# Altium schematic sheet MotorTreiber-µC.SchDoc
size A4
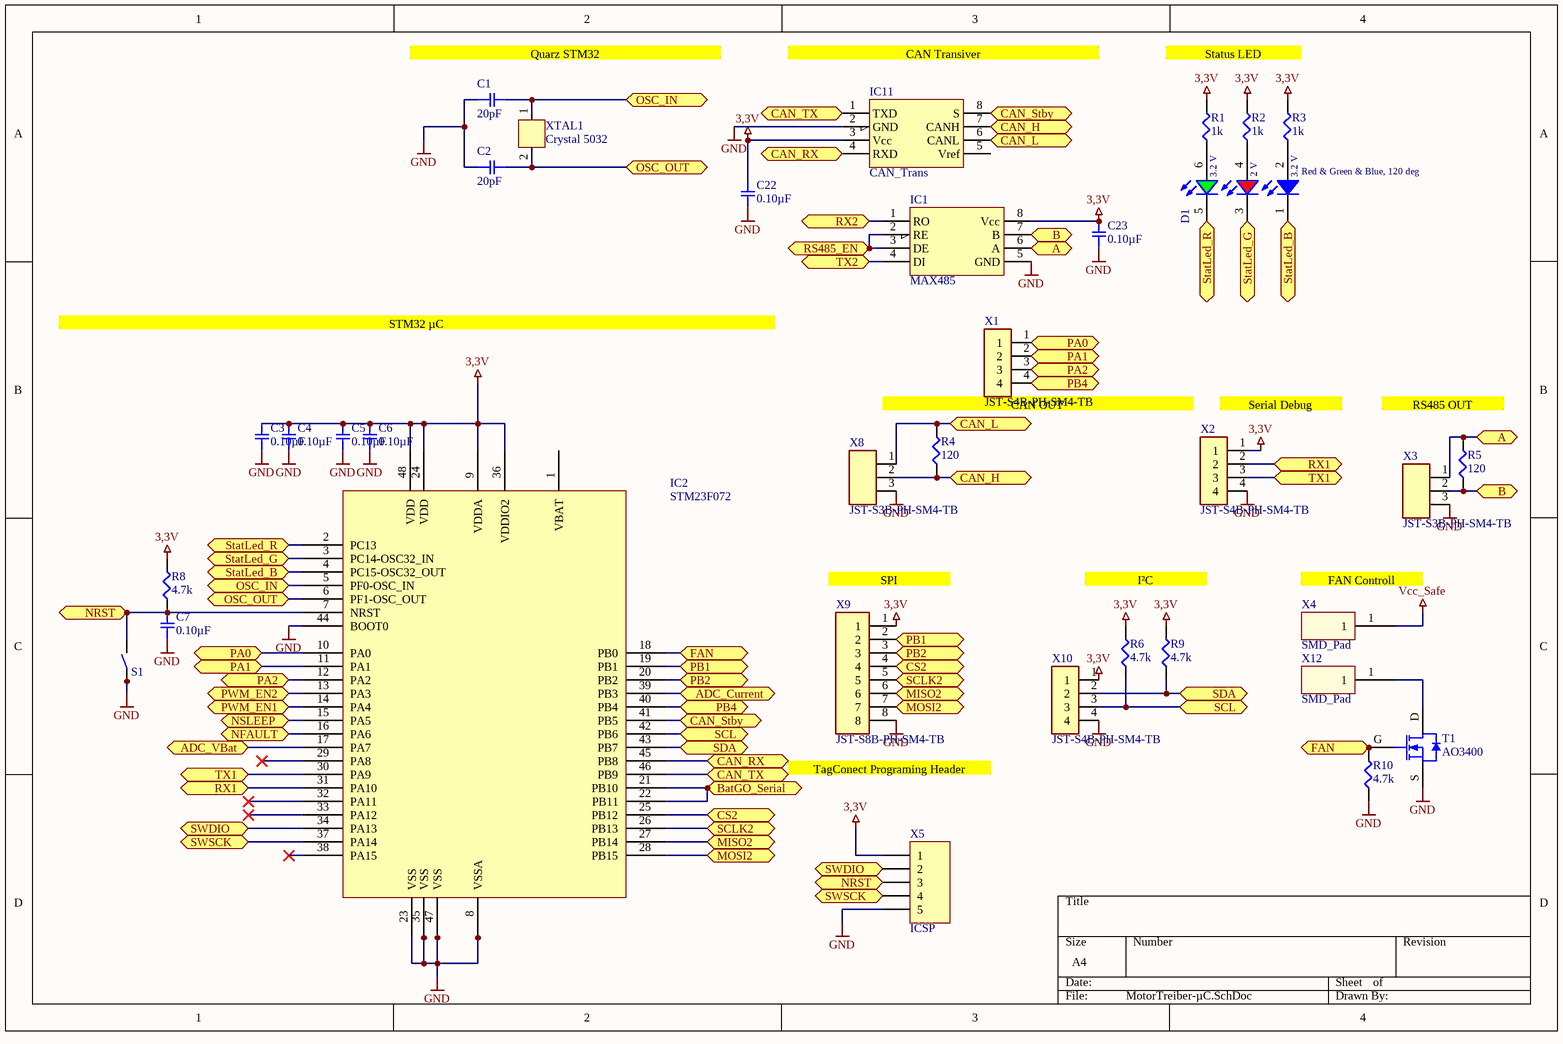
[diagram p0: MotorTreiber-µC.SchDoc]

## Parts
C1  20pF  [SMD-0402C]
C2  20pF  [SMD-0402C]
C3  0.10µF  [SMD-0402C]
C4  0.10µF  [SMD-0402C]
C5  0.10µF  [SMD-0402C]
C6  0.10µF  [SMD-0402C]
C7  0.10µF  [SMD-0402C]
C22  0.10µF  [SMD-0402C]
C23  0.10µF  [SMD-0402C]
D1  Red & Green & Blue, 120 deg  [WL-SFTW_3528_150352M173300]
IC1  MAX485  [D008_L]
IC2  STM23F072  [UFQFPN48]
IC11  CAN_Trans  [D008_L]
R1  1k  [SMD-0402-RES]
R2  1k  [SMD-0402-RES]
R3  1k  [SMD-0402-RES]
R4  120  [SMD-0402-RES]
R5  120  [SMD-0402-RES]
R6  4.7k  [SMD-0402-RES]
R8  4.7k  [SMD-0402-RES]
R9  4.7k  [SMD-0402-RES]
R10  4.7k  [SMD-0402-RES]
S1  Button  [Button5050]  (value not drawn)
T1  AO3400  [SOT23]
X1  JST-S4B-PH-SM4-TB  [JST-S4B-PH-SM4-TB]
X2  JST-S4B-PH-SM4-TB  [JST-S4B-PH-SM4-TB]
X3  JST-S3B-PH-SM4-TB  [JST-S3B-PH-SM4-TB]
X4  SMD_Pad  [SMD_Pad]
X5  ICSP  [TC2030-MCP-NL]
X8  JST-S3B-PH-SM4-TB  [JST-S3B-PH-SM4-TB]
X9  JST-S8B-PH-SM4-TB  [JST-S8B-PH-SM4-TB]
X10  JST-S4B-PH-SM4-TB  [JST-S4B-PH-SM4-TB]
X12  SMD_Pad  [SMD_Pad]
XTAL1  Crystal 5032  [5032]

## Ports
A (bidir), ADC_Current (bidir), ADC_VBat (bidir), B (bidir), BatGO_Serial (bidir), CAN_H (bidir), CAN_L (bidir), CAN_RX (bidir), CAN_Stby (bidir), CAN_TX (bidir), CS2 (bidir), FAN (bidir), MISO2 (bidir), MOSI2 (bidir), NFAULT (bidir), NRST (bidir), NSLEEP (bidir), OSC_IN (bidir), OSC_OUT (bidir), PA0 (bidir), PA1 (bidir), PA2 (bidir), PB1 (bidir), PB2 (bidir), PB4 (bidir), PWM_EN1 (bidir), PWM_EN2 (bidir), RS485_EN (bidir), RX1 (bidir), RX2 (bidir), SCL (bidir), SCLK2 (bidir), SDA (bidir), StatLed_B (bidir), StatLed_G (bidir), StatLed_R (bidir), SWDIO (bidir), SWSCK (bidir), TX1 (bidir), TX2 (bidir)

## Nets
3,3V: C3.2 C4.2 C5.2 C6.2 C22.2 C23.2 IC1.8(Vcc) IC2.9(VDDA) IC2.24(VDD) IC2.36(VDDIO2) IC2.48(VDD) IC11.3(Vcc) R1.2 R2.2 R3.2 R6.2 R8.2 R9.2 X2.1 X5.1 X9.1 X10.1
GND: C1.1 C2.1 C3.1 C4.1 C5.1 C6.1 C7.1 C22.1 C23.1 IC1.5(GND) IC2.8(VSSA) IC2.23(VSS) IC2.35(VSS) IC2.44(BOOT0) IC2.47(VSS) IC11.2(GND) R10.1 S1.1 T1.S X2.4 X3.3 X5.5 X8.3 X9.8 X10.4
Vcc_Safe: X4.1
A: IC1.6(A) R5.2 X3.1 ; port A
ADC_Current: IC2.39(PB3) ; port ADC_Current
ADC_VBat: IC2.17(PA7) ; port ADC_VBat
B: IC1.7(B) R5.1 X3.2 ; port B
BatGO_Serial: IC2.21(PB10) IC2.22(PB11) ; port BatGO_Serial
CAN_H: IC11.7(CANH) R4.1 X8.2 ; port CAN_H
CAN_L: IC11.6(CANL) R4.2 X8.1 ; port CAN_L
CAN_RX: IC2.45(PB8) IC11.4(RXD) ; port CAN_RX
CAN_Stby: IC2.41(PB5) IC11.8(S) ; port CAN_Stby
CAN_TX: IC2.46(PB9) IC11.1(TXD) ; port CAN_TX
CS2: IC2.25(PB12) X9.4 ; port CS2
FAN: IC2.18(PB0) R10.2 T1.G ; port FAN
MISO2: IC2.27(PB14) X9.6 ; port MISO2
MOSI2: IC2.28(PB15) X9.7 ; port MOSI2
NFAULT: IC2.16(PA6) ; port NFAULT
NRST: C7.2 IC2.7(NRST) R8.1 S1.2 X5.3 ; port NRST
NSLEEP: IC2.15(PA5) ; port NSLEEP
OSC_IN: C1.2 IC2.5(PF0-OSC_IN) XTAL1.1 ; port OSC_IN
OSC_OUT: C2.2 IC2.6(PF1-OSC_OUT) XTAL1.2 ; port OSC_OUT
PA0: IC2.10(PA0) X1.1 ; port PA0
PA1: IC2.11(PA1) X1.2 ; port PA1
PA2: IC2.12(PA2) X1.3 ; port PA2
PB1: IC2.19(PB1) X9.2 ; port PB1
PB2: IC2.20(PB2) X9.3 ; port PB2
PB4: IC2.40(PB4) X1.4 ; port PB4
PWM_EN1: IC2.14(PA4) ; port PWM_EN1
PWM_EN2: IC2.13(PA3) ; port PWM_EN2
RS485_EN: IC1.2(RE) IC1.3(DE) ; port RS485_EN
RX1: IC2.31(PA10) X2.2 ; port RX1
RX2: IC1.1(RO) ; port RX2
SCL: IC2.42(PB6) R6.1 X10.3 ; port SCL
SCLK2: IC2.26(PB13) X9.5 ; port SCLK2
SDA: IC2.43(PB7) R9.1 X10.2 ; port SDA
StatLed_B: D1.1(K) IC2.4(PC15-OSC32_OUT) ; port StatLed_B
StatLed_G: D1.3(K) IC2.3(PC14-OSC32_IN) ; port StatLed_G
StatLed_R: D1.5(K) IC2.2(PC13) ; port StatLed_R
SWDIO: IC2.34(PA13) X5.2 ; port SWDIO
SWSCK: IC2.37(PA14) X5.4 ; port SWSCK
TX1: IC2.30(PA9) X2.3 ; port TX1
TX2: IC1.4(DI) ; port TX2
NetD1_2: D1.2(A) R3.1
NetD1_4: D1.4(A) R2.1
NetD1_6: D1.6(A) R1.1
NetT1_D: T1.D X12.1

Not connected (* = marked no-connect by the designer): IC2 1(VBAT) 29(PA8)* 32(PA11)* 33(PA12)* 38(PA15)*; IC11 5(Vref)

## Notes on the sheet
- Quarz STM32
- CAN Transiver
- Status LED
- STM32 µC
  STM32 µC
- (near X1) CAN OUT
- (near X2) Serial Debug
- (near R5) RS485 OUT
- (near X9) SPI
- I²C
- (near X4) FAN Controll
- (near X9) TagConect Programing Header
- (in symbol 150352M173300) 3.2 V; 2 V

## Library data of the parts
C1 C2 = GJM1555C1H200GB01D: CAP CER 20PF 50V NP0 0402; Manufacturer: Murata Electronics North America; Factory Stock: 0; Unit Price (USD): 0.2; Minimum Quantity: 1; Tolerance: ±2%; Temperature Coefficient: C0G, NP0; Datasheets: http://www.murata.com/~/media/webrenewal/support/library/catalog/products/capacitor/mlcc/c02e.pdf; Image: //media.digikey.com/Renders/Murata%20Renders/ZRB-SERIES-0402.jpg; Digi-Key Part Number: 490-8090-1-ND; Part Number: GJM1555C1H200GB01D; Quantity Available: 18876; @ qty: 0; Packaging: Cut Tape (CT); Series: GJM; Part Status: Active; Value: 20pF; Voltage: 50V; Operating Temperature: -55°C ~ 125°C; Features: High Q, Low Loss; Ratings: -; Applications: RF, Microwave, High Frequency; Mounting Type: Surface Mount, MLCC; Package / Case: 0402 (1005 Metric); Size / Dimension: 0.039" L x 0.020" W (1.00mm x 0.50mm); Height - Seated (Max): -; Thickness (Max): 0.022" (0.55mm); Lead Spacing: -; Lead Style: -
C3-C7 C22 C23 = GCM155R71C104KA55D: CAP CER 0.1UF 16V X7R 0402; Manufacturer: Murata Electronics North America; Factory Stock: 0; Unit Price (USD): 0.1; Minimum Quantity: 1; Tolerance: ±10%; Datasheets: http://www.murata.com/~/media/webrenewal/support/library/catalog/products/capacitor/mlcc/c03e.ashx; Image: //media.digikey.com/Renders/Murata%20Renders/ZRB-SERIES-0402.jpg; Digi-Key Part Number: 490-4759-1-ND; Part Number: GCM155R71C104KA55D; Quantity Available: 734194; @ qty: 0; Packaging: Cut Tape (CT); Series: GCM; Part Status: Active; Value: 0.10µF; Voltage: 16V; Temperature Coefficient: X7R; Operating Temperature: -55°C ~ 125°C; Features: -; Ratings: AEC-Q200; Applications: Automotive; Mounting Type: Surface Mount, MLCC; Package / Case: 0402 (1005 Metric); Size / Dimension: 0.039" L x 0.020" W (1.00mm x 0.50mm); Height - Seated (Max): -; Thickness (Max): 0.022" (0.55mm); Lead Spacing: -; Lead Style: -
D1 = 150352M173300: SMT Full-color TOP LED Waterclear WL-SFTW, size 3528, Red & Green & Blue, 120 deg; Viewing Angle: 120 deg; Peak Wavelength: 465 nm@Blue, 515 nm@Green, 635 nm@Red; Dominant Wavelength: 470 nm@Blue, 520 nm@Green, 625 nm@Red; Luminous Intensity: 400 mcd@Blue, 1700 mcd@Green, 750 mcd@Red; Chip Technology: AlInGaP + InGaN; Forward Voltage: 3.2 V@Blue, 3.2 V@Green, 2 V@Red; ComponentLink1Description: Manufacturer; ComponentLink1URL: http://www.we-online.de; ComponentLink2Description: Datasheet; ComponentLink2URL: https://katalog.we-online.de/led/datasheet/150352M173300.pdf; Part Number: 150352M173300; Published Date: December 2018; Publisher: Wurth Elektronik; Size: 3528; Operating Temperature: -40 to +85 degC; Emitting Color: Red & Green & Blue; Mounting Technology: SMT; Packaging: Tape and Reel
IC2 = STM32F072C8U6
R1-R3 = ERJ-2GEJ102X: RES SMD 1K OHM 5% 1/10W 0402; Manufacturer: Panasonic Electronic Components; Factory Stock: 0; Unit Price (USD): 0.00350; @ qty: 1500; Minimum Quantity: 1; Power (Watts): 0.1W, 1/10W; Temperature Coefficient: ±200ppm/°C; Part Number: ERJ-2GEJ102X; Datasheets: http://industrial.panasonic.com/www-cgi/jvcr13pz.cgi?E+PZ+3+AOA0001+ERJ2GEJ102X+7+WW; Image: //media.digikey.com/Photos/Panasonic%20Photos/ERJ-PA2-Series.jpg; Digi-Key Part Number: P1.0KJCT-ND; Quantity Available: 1939857; Packaging: Cut Tape (CT); Series: ERJ; Part Status: Active; Value: 1k; Tolerance: ±5%; Composition: Thick Film; Features: Automotive AEC-Q200; Operating Temperature: -55°C ~ 155°C; Package / Case: 0402 (1005 Metric); Supplier Device Package: 0402; Size / Dimension: 0.039" L x 0.020" W (1.00mm x 0.50mm); Height - Seated (Max): 0.016" (0.40mm); Number of Terminations: 2; Failure Rate: -
R4 R5 = ERJ-2RKF1200X: RES SMD 120 OHM 1% 1/10W 0402; Manufacturer: Panasonic Electronic Components; Factory Stock: 0; Unit Price (USD): 0.00496; @ qty: 1500; Minimum Quantity: 1; Power (Watts): 0.1W, 1/10W; Temperature Coefficient: ±100ppm/°C; Part Number: ERJ-2RKF1200X; Datasheets: http://industrial.panasonic.com/www-cgi/jvcr13pz.cgi?E+PZ+3+AOA0002+ERJ2RKF1200X+7+WW; Image: //media.digikey.com/Photos/Panasonic%20Photos/ERJ-PA2-Series.jpg; Digi-Key Part Number: P120LCT-ND; Quantity Available: 258171; Packaging: Cut Tape (CT); Series: ERJ; Part Status: Active; Value: 120; Tolerance: ±1%; Composition: Thick Film; Features: Automotive AEC-Q200; Operating Temperature: -55°C ~ 155°C; Package / Case: 0402 (1005 Metric); Supplier Device Package: 0402; Size / Dimension: 0.039" L x 0.020" W (1.00mm x 0.50mm); Height - Seated (Max): 0.016" (0.40mm); Number of Terminations: 2; Failure Rate: -
R6 R8-R10 = ERJ-2GEJ472X: RES SMD 4.7K OHM 5% 1/10W 0402; Manufacturer: Panasonic Electronic Components; Factory Stock: 0; Unit Price (USD): 0.00350; @ qty: 1500; Minimum Quantity: 1; Power (Watts): 0.1W, 1/10W; Temperature Coefficient: ±200ppm/°C; Part Number: ERJ-2GEJ472X; Datasheets: http://industrial.panasonic.com/www-cgi/jvcr13pz.cgi?E+PZ+3+AOA0001+ERJ2GEJ472X+7+WW; Image: //media.digikey.com/Photos/Panasonic%20Photos/ERJ-PA2-Series.jpg; Digi-Key Part Number: P4.7KJCT-ND; Quantity Available: 8551774; Packaging: Cut Tape (CT); Series: ERJ; Part Status: Active; Value: 4.7k; Tolerance: ±5%; Composition: Thick Film; Features: Automotive AEC-Q200; Operating Temperature: -55°C ~ 155°C; Package / Case: 0402 (1005 Metric); Supplier Device Package: 0402; Size / Dimension: 0.039" L x 0.020" W (1.00mm x 0.50mm); Height - Seated (Max): 0.016" (0.40mm); Number of Terminations: 2; Failure Rate: -
S1 = Button: 6.1x3.7x2.5mm
T1 = AO3400: AO3400 MOSFET 30V
X1 X2 X10 = JST-S4B-PH-SM4-TB: JST Connector; Manufacturer_Name: JST (JAPAN SOLDERLESS TERMINALS); Manufacturer_Part_Number: B4B-PH-SM3-TB; Datasheet Link: http://media.digikey.com/pdf/Data%20Sheets/JST%20PDFs/PH%20Series.pdf; Height: 6.6mm; Arrow Part Number: B4B-PH-SM3-TB
X3 X8 = JST-S3B-PH-SM4-TB: JST Connector
X9 = JST-S8B-PH-SM4-TB: JST Connector; Manufacturer_Name: JST (JAPAN SOLDERLESS TERMINALS); Manufacturer_Part_Number: B8B-PH-SM4-TB(LF)(SN); Datasheet Link: http://uk.rs-online.com/web/p/products/6881347; Arrow Part Number: B8B-PH-SM4-TB(LF)(SN); Arrow Price/Stock: https://www.arrow.com/en/products/b8b-ph-sm4-tb-lf-sn/jst-manufacturing
XTAL1 = 5032